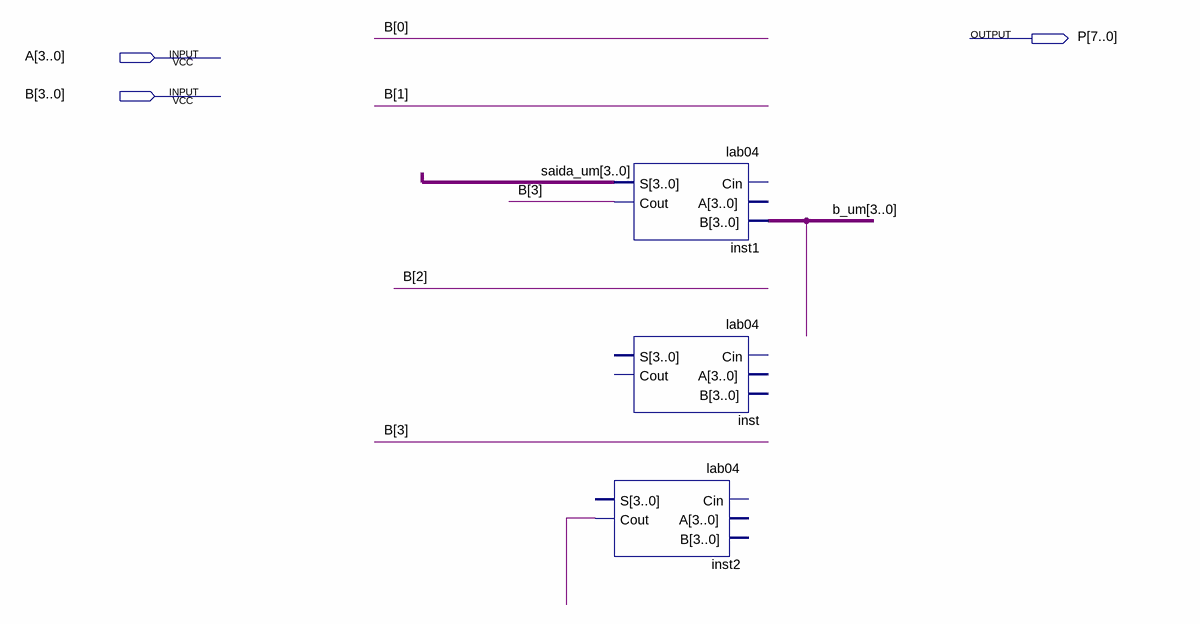
[diagram p0: schematic sheet]
// Quartus schematic lab4.bdf as structural Verilog: 3 symbols, 3 pins
module lab4 (
  input  [3:0] A,
  input  [3:0] B,
  output [7:0] P
);

  wire inst2_cout;
  wire [3:0] b_um, saida_um;

  lab04 inst1 (.B(b_um), .S(saida_um), .Cout(B[3]));  // open: Cin, A
  lab04 inst ();  // open: Cin, A, B, S, Cout
  lab04 inst2 (.Cout(inst2_cout));  // open: Cin, A, B, S
endmodule
